# Altium schematic sheet Output.SchDoc
size A2; SheetNumber: 4; SheetTotal: 6
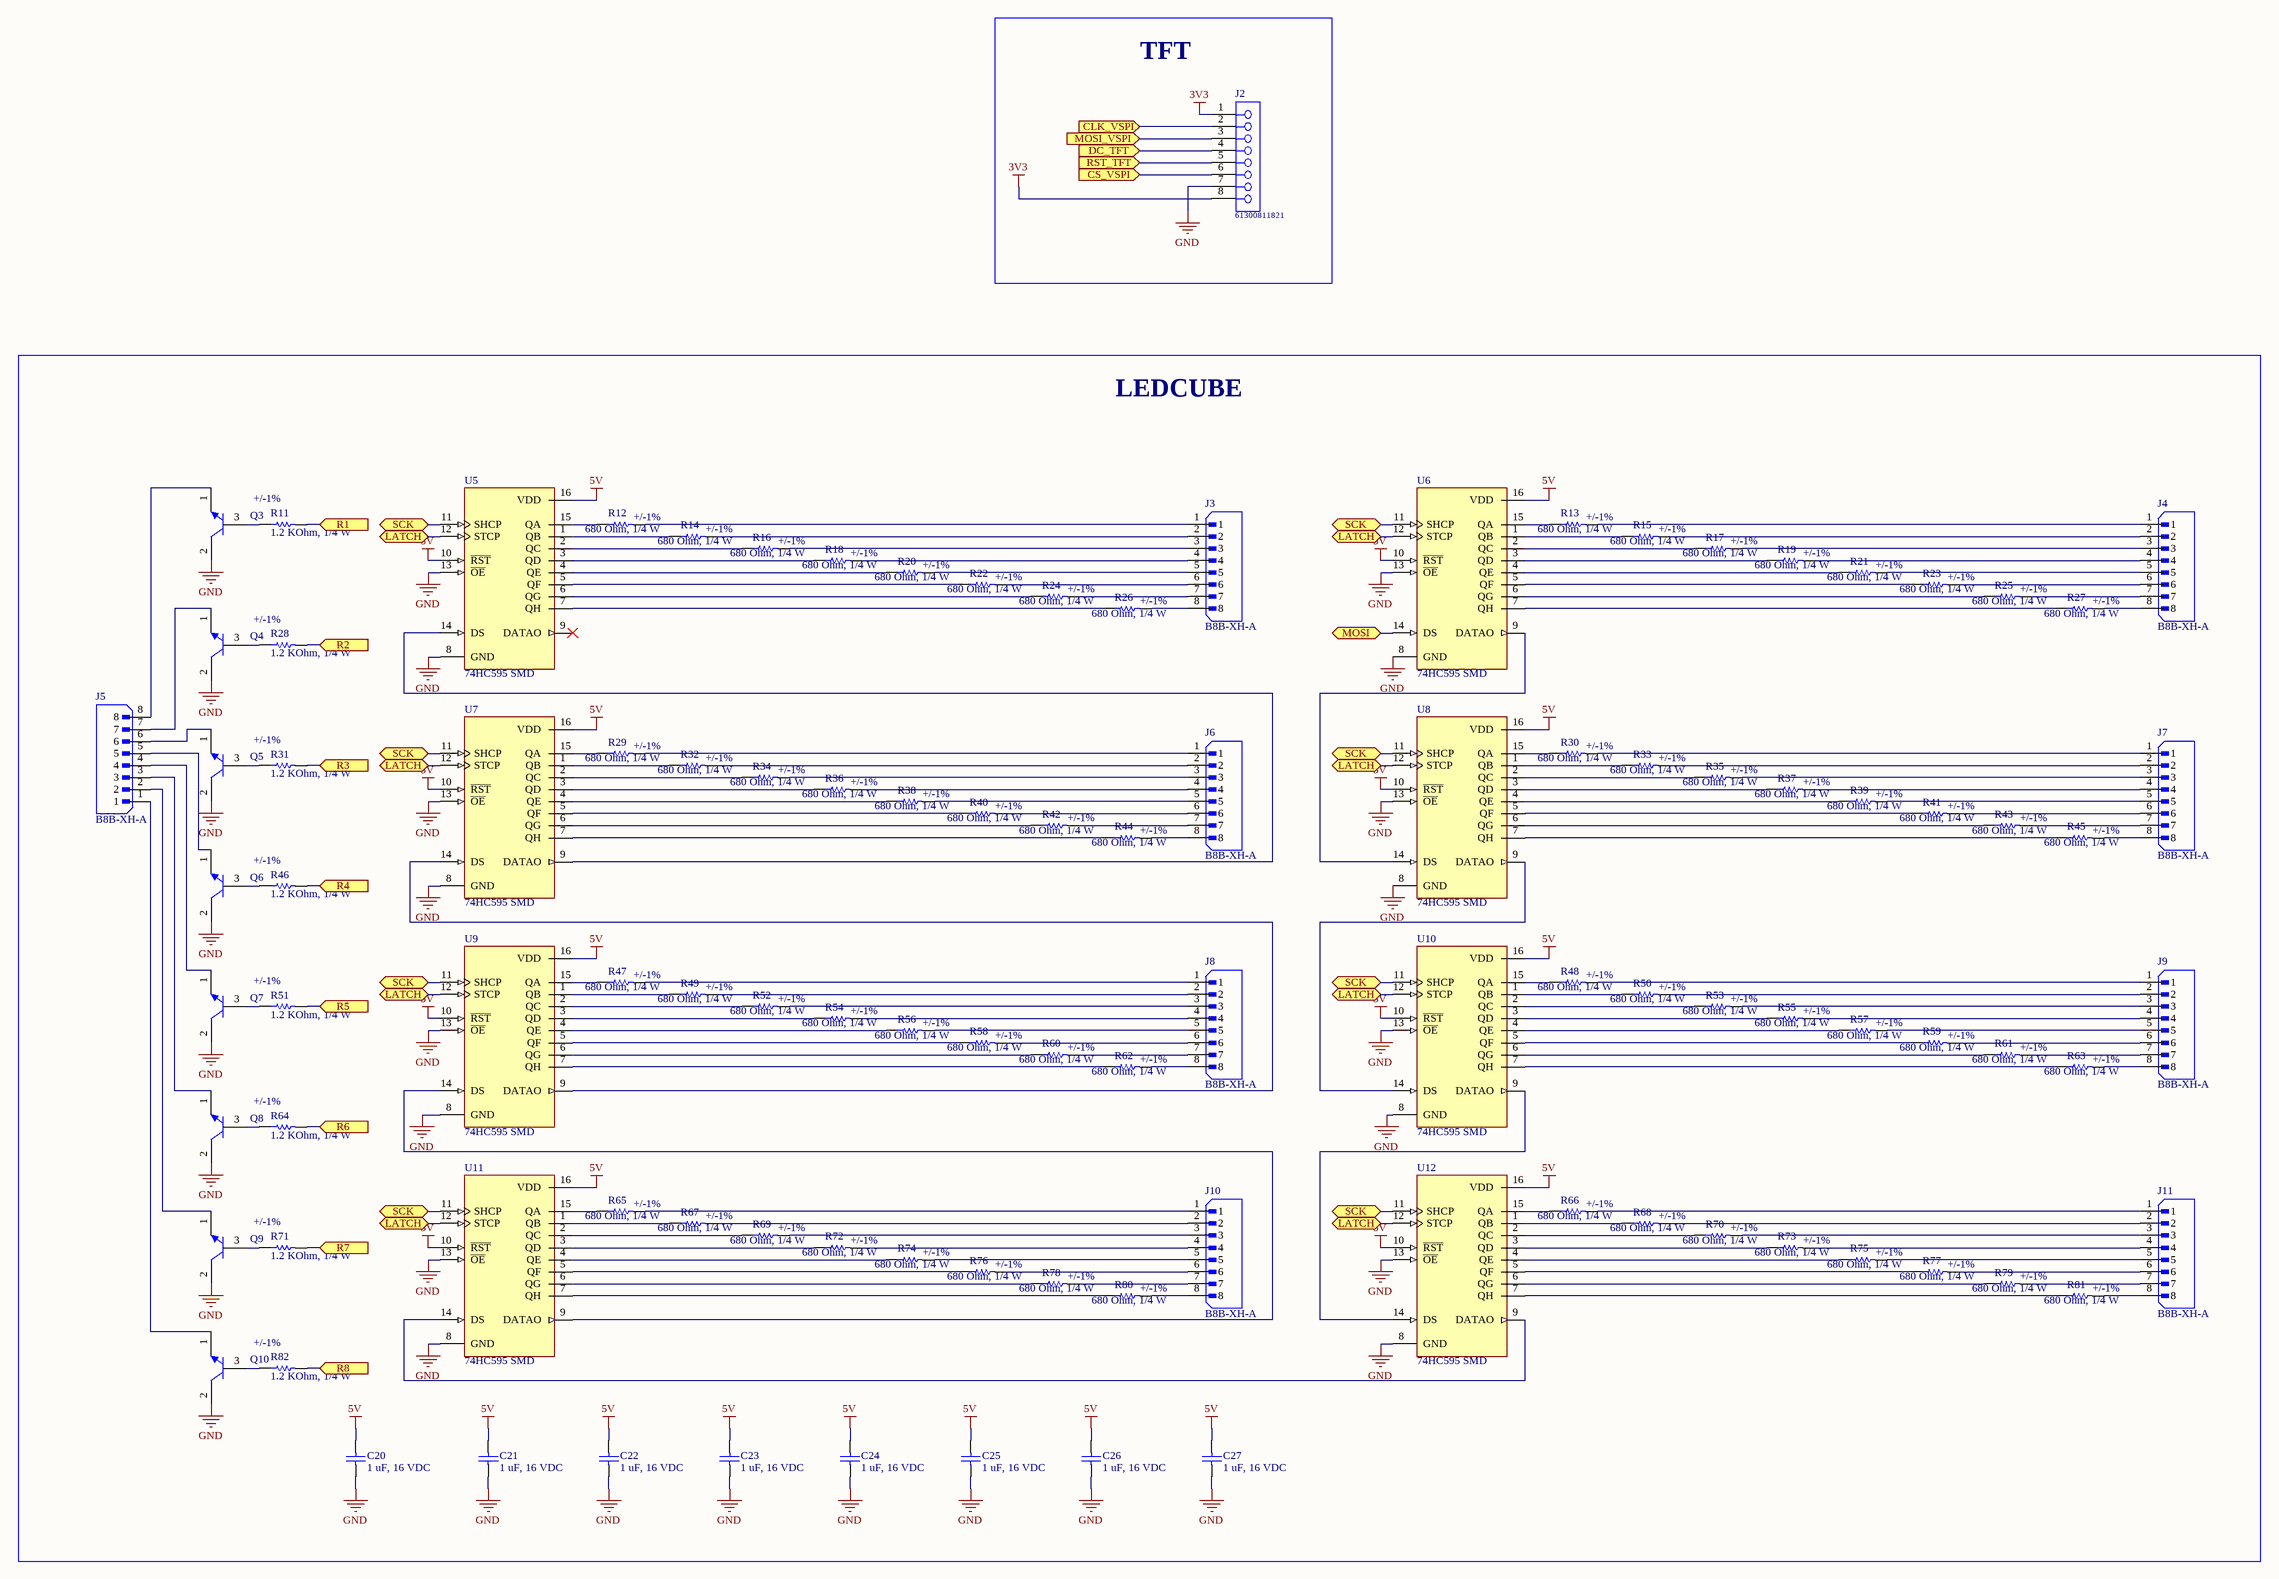
[diagram p0: Output.SchDoc]

## Parts
C20  1 uF, 16 VDC  [CAP_0603]
C21  1 uF, 16 VDC  [CAP_0603]
C22  1 uF, 16 VDC  [CAP_0603]
C23  1 uF, 16 VDC  [CAP_0603]
C24  1 uF, 16 VDC  [CAP_0603]
C25  1 uF, 16 VDC  [CAP_0603]
C26  1 uF, 16 VDC  [CAP_0603]
C27  1 uF, 16 VDC  [CAP_0603]
J2  61300811821  [61300811821]
J3  B8B-XH-A  [JST_B8B-XH-A]
J4  B8B-XH-A  [JST_B8B-XH-A]
J5  B8B-XH-A  [JST_B8B-XH-A]
J6  B8B-XH-A  [JST_B8B-XH-A]
J7  B8B-XH-A  [JST_B8B-XH-A]
J8  B8B-XH-A  [JST_B8B-XH-A]
J9  B8B-XH-A  [JST_B8B-XH-A]
J10  B8B-XH-A  [JST_B8B-XH-A]
J11  B8B-XH-A  [JST_B8B-XH-A]
Q3  C1815  [SOT23B]  (value not drawn)
Q4  C1815  [SOT23B]  (value not drawn)
Q5  C1815  [SOT23B]  (value not drawn)
Q6  C1815  [SOT23B]  (value not drawn)
Q7  C1815  [SOT23B]  (value not drawn)
Q8  C1815  [SOT23B]  (value not drawn)
Q9  C1815  [SOT23B]  (value not drawn)
Q10  C1815  [SOT23B]  (value not drawn)
R11  1.2 KOhm, 1/4 W  Resistance Tolerance: +/-1%  [resistor_0603]
R12  680 Ohm, 1/4 W  Resistance Tolerance: +/-1%  [resistor_0603]
R13  680 Ohm, 1/4 W  Resistance Tolerance: +/-1%  [resistor_0603]
R14  680 Ohm, 1/4 W  Resistance Tolerance: +/-1%  [resistor_0603]
R15  680 Ohm, 1/4 W  Resistance Tolerance: +/-1%  [resistor_0603]
R16  680 Ohm, 1/4 W  Resistance Tolerance: +/-1%  [resistor_0603]
R17  680 Ohm, 1/4 W  Resistance Tolerance: +/-1%  [resistor_0603]
R18  680 Ohm, 1/4 W  Resistance Tolerance: +/-1%  [resistor_0603]
R19  680 Ohm, 1/4 W  Resistance Tolerance: +/-1%  [resistor_0603]
R20  680 Ohm, 1/4 W  Resistance Tolerance: +/-1%  [resistor_0603]
R21  680 Ohm, 1/4 W  Resistance Tolerance: +/-1%  [resistor_0603]
R22  680 Ohm, 1/4 W  Resistance Tolerance: +/-1%  [resistor_0603]
R23  680 Ohm, 1/4 W  Resistance Tolerance: +/-1%  [resistor_0603]
R24  680 Ohm, 1/4 W  LATCH: +/-1%  [resistor_0603]
R25  680 Ohm, 1/4 W  Resistance Tolerance: +/-1%  [resistor_0603]
R26  680 Ohm, 1/4 W  Resistance Tolerance: +/-1%  [resistor_0603]
R27  680 Ohm, 1/4 W  Resistance Tolerance: +/-1%  [resistor_0603]
R28  1.2 KOhm, 1/4 W  Resistance Tolerance: +/-1%  [resistor_0603]
R29  680 Ohm, 1/4 W  Resistance Tolerance: +/-1%  [resistor_0603]
R30  680 Ohm, 1/4 W  Resistance Tolerance: +/-1%  [resistor_0603]
R31  1.2 KOhm, 1/4 W  Resistance Tolerance: +/-1%  [resistor_0603]
R32  680 Ohm, 1/4 W  Resistance Tolerance: +/-1%  [resistor_0603]
R33  680 Ohm, 1/4 W  Resistance Tolerance: +/-1%  [resistor_0603]
R34  680 Ohm, 1/4 W  Resistance Tolerance: +/-1%  [resistor_0603]
R35  680 Ohm, 1/4 W  Resistance Tolerance: +/-1%  [resistor_0603]
R36  680 Ohm, 1/4 W  Resistance Tolerance: +/-1%  [resistor_0603]
R37  680 Ohm, 1/4 W  Resistance Tolerance: +/-1%  [resistor_0603]
R38  680 Ohm, 1/4 W  Resistance Tolerance: +/-1%  [resistor_0603]
R39  680 Ohm, 1/4 W  Resistance Tolerance: +/-1%  [resistor_0603]
R40  680 Ohm, 1/4 W  Resistance Tolerance: +/-1%  [resistor_0603]
R41  680 Ohm, 1/4 W  Resistance Tolerance: +/-1%  [resistor_0603]
R42  680 Ohm, 1/4 W  Resistance Tolerance: +/-1%  [resistor_0603]
R43  680 Ohm, 1/4 W  Resistance Tolerance: +/-1%  [resistor_0603]
R44  680 Ohm, 1/4 W  Resistance Tolerance: +/-1%  [resistor_0603]
R45  680 Ohm, 1/4 W  Resistance Tolerance: +/-1%  [resistor_0603]
R46  1.2 KOhm, 1/4 W  Resistance Tolerance: +/-1%  [resistor_0603]
R47  680 Ohm, 1/4 W  Resistance Tolerance: +/-1%  [resistor_0603]
R48  680 Ohm, 1/4 W  Resistance Tolerance: +/-1%  [resistor_0603]
R49  680 Ohm, 1/4 W  Resistance Tolerance: +/-1%  [resistor_0603]
R50  680 Ohm, 1/4 W  Resistance Tolerance: +/-1%  [resistor_0603]
R51  1.2 KOhm, 1/4 W  Resistance Tolerance: +/-1%  [resistor_0603]
R52  680 Ohm, 1/4 W  Resistance Tolerance: +/-1%  [resistor_0603]
R53  680 Ohm, 1/4 W  Resistance Tolerance: +/-1%  [resistor_0603]
R54  680 Ohm, 1/4 W  Resistance Tolerance: +/-1%  [resistor_0603]
R55  680 Ohm, 1/4 W  Resistance Tolerance: +/-1%  [resistor_0603]
R56  680 Ohm, 1/4 W  Resistance Tolerance: +/-1%  [resistor_0603]
R57  680 Ohm, 1/4 W  Resistance Tolerance: +/-1%  [resistor_0603]
R58  680 Ohm, 1/4 W  Resistance Tolerance: +/-1%  [resistor_0603]
R59  680 Ohm, 1/4 W  Resistance Tolerance: +/-1%  [resistor_0603]
R60  680 Ohm, 1/4 W  Resistance Tolerance: +/-1%  [resistor_0603]
R61  680 Ohm, 1/4 W  Resistance Tolerance: +/-1%  [resistor_0603]
R62  680 Ohm, 1/4 W  Resistance Tolerance: +/-1%  [resistor_0603]
R63  680 Ohm, 1/4 W  Resistance Tolerance: +/-1%  [resistor_0603]
R64  1.2 KOhm, 1/4 W  Resistance Tolerance: +/-1%  [resistor_0603]
R65  680 Ohm, 1/4 W  Resistance Tolerance: +/-1%  [resistor_0603]
R66  680 Ohm, 1/4 W  Resistance Tolerance: +/-1%  [resistor_0603]
R67  680 Ohm, 1/4 W  Resistance Tolerance: +/-1%  [resistor_0603]
R68  680 Ohm, 1/4 W  Resistance Tolerance: +/-1%  [resistor_0603]
R69  680 Ohm, 1/4 W  Resistance Tolerance: +/-1%  [resistor_0603]
R70  680 Ohm, 1/4 W  Resistance Tolerance: +/-1%  [resistor_0603]
R71  1.2 KOhm, 1/4 W  Resistance Tolerance: +/-1%  [resistor_0603]
R72  680 Ohm, 1/4 W  Resistance Tolerance: +/-1%  [resistor_0603]
R73  680 Ohm, 1/4 W  Resistance Tolerance: +/-1%  [resistor_0603]
R74  680 Ohm, 1/4 W  Resistance Tolerance: +/-1%  [resistor_0603]
R75  680 Ohm, 1/4 W  Resistance Tolerance: +/-1%  [resistor_0603]
R76  680 Ohm, 1/4 W  Resistance Tolerance: +/-1%  [resistor_0603]
R77  680 Ohm, 1/4 W  Resistance Tolerance: +/-1%  [resistor_0603]
R78  680 Ohm, 1/4 W  Resistance Tolerance: +/-1%  [resistor_0603]
R79  680 Ohm, 1/4 W  Resistance Tolerance: +/-1%  [resistor_0603]
R80  680 Ohm, 1/4 W  Resistance Tolerance: +/-1%  [resistor_0603]
R81  680 Ohm, 1/4 W  Resistance Tolerance: +/-1%  [resistor_0603]
R82  1.2 KOhm, 1/4 W  Resistance Tolerance: +/-1%  [resistor_0603]
U5  74HC595 SMD  [SOP 16]
U6  74HC595 SMD  [SOP 16]
U7  74HC595 SMD  [SOP 16]
U8  74HC595 SMD  [SOP 16]
U9  74HC595 SMD  [SOP 16]
U10  74HC595 SMD  [SOP 16]
U11  74HC595 SMD  [SOP 16]
U12  74HC595 SMD  [SOP 16]

## Blocks framed on the sheet
TFT: J2
LEDCUBE: C20-C27 J3-J11 Q3-Q10 R11-R82 U5-U12

## Ports
CLK_VSPI (in, see ESP32[2B]), CS_VSPI (in, see ESP32[2B]), DC_TFT (in, see ESP32[1B]), LATCH (bidir, see MCU[1A], Output[2B], Output[2C], Output[5B], Output[5C]), MOSI (bidir, see MCU[1A]), MOSI_VSPI (in, see ESP32[2B]), R1 (in, see MCU[1B]), R2 (in, see MCU[2A]), R3 (in, see MCU[2A]), R4 (in, see MCU[2A]), R5 (in, see MCU[2A]), R6 (in, see MCU[2A]), R7 (in, see MCU[2A]), R8 (in, see MCU[2B]), RST_TFT (in, see ESP32[1B]), SCK (bidir, see MCU[1A], Output[2B], Output[2C], Output[5B], Output[5C])

## Nets
3V3: J2.1 J2.8
5V: C20.2 C21.2 C22.2 C23.2 C24.2 C25.2 C26.2 C27.2 U5.10(~{RST}) U5.16(VDD) U6.10(~{RST}) U6.16(VDD) U7.10(~{RST}) U7.16(VDD) U8.10(~{RST}) U8.16(VDD) U9.10(~{RST}) U9.16(VDD) U10.10(~{RST}) U10.16(VDD) U11.10(~{RST}) U11.16(VDD) U12.10(~{RST}) U12.16(VDD)
GND: C20.1 C21.1 C22.1 C23.1 C24.1 C25.1 C26.1 C27.1 J2.7 Q3.2(C) Q4.2(C) Q5.2(C) Q6.2(C) Q7.2(C) Q8.2(C) Q9.2(C) Q10.2(C) U5.8(GND) U5.13(~{OE}) U6.8(GND) U6.13(~{OE}) U7.8(GND) U7.13(~{OE}) U8.8(GND) U8.13(~{OE}) U9.8(GND) U9.13(~{OE}) U10.8(GND) U10.13(~{OE}) U11.8(GND) U11.13(~{OE}) U12.8(GND) U12.13(~{OE})
CLK_VSPI: J2.2 ; port CLK_VSPI
CS_VSPI: J2.6 ; port CS_VSPI
DC_TFT: J2.4 ; port DC_TFT
LATCH: U5.12(STCP) U6.12(STCP) U7.12(STCP) U8.12(STCP) U9.12(STCP) U10.12(STCP) U11.12(STCP) U12.12(STCP) ; port LATCH
MOSI: U6.14(DS) ; port MOSI
MOSI_VSPI: J2.3 ; port MOSI_VSPI
R1: R11.2 ; port R1
R2: R28.2 ; port R2
R3: R31.2 ; port R3
R4: R46.2 ; port R4
R5: R51.2 ; port R5
R6: R64.2 ; port R6
R7: R71.2 ; port R7
R8: R82.2 ; port R8
RST_TFT: J2.5 ; port RST_TFT
SCK: U5.11(SHCP) U6.11(SHCP) U7.11(SHCP) U8.11(SHCP) U9.11(SHCP) U10.11(SHCP) U11.11(SHCP) U12.11(SHCP) ; port SCK
NetJ3_1: J3.1 R12.2
NetJ3_2: J3.2 R14.2
NetJ3_3: J3.3 R16.2
NetJ3_4: J3.4 R18.2
NetJ3_5: J3.5 R20.2
NetJ3_6: J3.6 R22.2
NetJ3_7: J3.7 R24.2
NetJ3_8: J3.8 R26.2
NetJ4_1: J4.1 R13.2
NetJ4_2: J4.2 R15.2
NetJ4_3: J4.3 R17.2
NetJ4_4: J4.4 R19.2
NetJ4_5: J4.5 R21.2
NetJ4_6: J4.6 R23.2
NetJ4_7: J4.7 R25.2
NetJ4_8: J4.8 R27.2
NetJ5_1: J5.1 Q10.1(E)
NetJ5_2: J5.2 Q9.1(E)
NetJ5_3: J5.3 Q8.1(E)
NetJ5_4: J5.4 Q7.1(E)
NetJ5_5: J5.5 Q6.1(E)
NetJ5_6: J5.6 Q5.1(E)
NetJ5_7: J5.7 Q4.1(E)
NetJ5_8: J5.8 Q3.1(E)
NetJ6_1: J6.1 R29.2
NetJ6_2: J6.2 R32.2
NetJ6_3: J6.3 R34.2
NetJ6_4: J6.4 R36.2
NetJ6_5: J6.5 R38.2
NetJ6_6: J6.6 R40.2
NetJ6_7: J6.7 R42.2
NetJ6_8: J6.8 R44.2
NetJ7_1: J7.1 R30.2
NetJ7_2: J7.2 R33.2
NetJ7_3: J7.3 R35.2
NetJ7_4: J7.4 R37.2
NetJ7_5: J7.5 R39.2
NetJ7_6: J7.6 R41.2
NetJ7_7: J7.7 R43.2
NetJ7_8: J7.8 R45.2
NetJ8_1: J8.1 R47.2
NetJ8_2: J8.2 R49.2
NetJ8_3: J8.3 R52.2
NetJ8_4: J8.4 R54.2
NetJ8_5: J8.5 R56.2
NetJ8_6: J8.6 R58.2
NetJ8_7: J8.7 R60.2
NetJ8_8: J8.8 R62.2
NetJ9_1: J9.1 R48.2
NetJ9_2: J9.2 R50.2
NetJ9_3: J9.3 R53.2
NetJ9_4: J9.4 R55.2
NetJ9_5: J9.5 R57.2
NetJ9_6: J9.6 R59.2
NetJ9_7: J9.7 R61.2
NetJ9_8: J9.8 R63.2
NetJ10_1: J10.1 R65.2
NetJ10_2: J10.2 R67.2
NetJ10_3: J10.3 R69.2
NetJ10_4: J10.4 R72.2
NetJ10_5: J10.5 R74.2
NetJ10_6: J10.6 R76.2
NetJ10_7: J10.7 R78.2
NetJ10_8: J10.8 R80.2
NetJ11_1: J11.1 R66.2
NetJ11_2: J11.2 R68.2
NetJ11_3: J11.3 R70.2
NetJ11_4: J11.4 R73.2
NetJ11_5: J11.5 R75.2
NetJ11_6: J11.6 R77.2
NetJ11_7: J11.7 R79.2
NetJ11_8: J11.8 R81.2
NetQ3_3: Q3.3(B) R11.1
NetQ4_3: Q4.3(B) R28.1
NetQ5_3: Q5.3(B) R31.1
NetQ6_3: Q6.3(B) R46.1
NetQ7_3: Q7.3(B) R51.1
NetQ8_3: Q8.3(B) R64.1
NetQ9_3: Q9.3(B) R71.1
NetQ10_3: Q10.3(B) R82.1
NetR12_1: R12.1 U5.15(QA)
NetR13_1: R13.1 U6.15(QA)
NetR14_1: R14.1 U5.1(QB)
NetR15_1: R15.1 U6.1(QB)
NetR16_1: R16.1 U5.2(QC)
NetR17_1: R17.1 U6.2(QC)
NetR18_1: R18.1 U5.3(QD)
NetR19_1: R19.1 U6.3(QD)
NetR20_1: R20.1 U5.4(QE)
NetR21_1: R21.1 U6.4(QE)
NetR22_1: R22.1 U5.5(QF)
NetR23_1: R23.1 U6.5(QF)
NetR24_1: R24.1 U5.6(QG)
NetR25_1: R25.1 U6.6(QG)
NetR26_1: R26.1 U5.7(QH)
NetR27_1: R27.1 U6.7(QH)
NetR29_1: R29.1 U7.15(QA)
NetR30_1: R30.1 U8.15(QA)
NetR32_1: R32.1 U7.1(QB)
NetR33_1: R33.1 U8.1(QB)
NetR34_1: R34.1 U7.2(QC)
NetR35_1: R35.1 U8.2(QC)
NetR36_1: R36.1 U7.3(QD)
NetR37_1: R37.1 U8.3(QD)
NetR38_1: R38.1 U7.4(QE)
NetR39_1: R39.1 U8.4(QE)
NetR40_1: R40.1 U7.5(QF)
NetR41_1: R41.1 U8.5(QF)
NetR42_1: R42.1 U7.6(QG)
NetR43_1: R43.1 U8.6(QG)
NetR44_1: R44.1 U7.7(QH)
NetR45_1: R45.1 U8.7(QH)
NetR47_1: R47.1 U9.15(QA)
NetR48_1: R48.1 U10.15(QA)
NetR49_1: R49.1 U9.1(QB)
NetR50_1: R50.1 U10.1(QB)
NetR52_1: R52.1 U9.2(QC)
NetR53_1: R53.1 U10.2(QC)
NetR54_1: R54.1 U9.3(QD)
NetR55_1: R55.1 U10.3(QD)
NetR56_1: R56.1 U9.4(QE)
NetR57_1: R57.1 U10.4(QE)
NetR58_1: R58.1 U9.5(QF)
NetR59_1: R59.1 U10.5(QF)
NetR60_1: R60.1 U9.6(QG)
NetR61_1: R61.1 U10.6(QG)
NetR62_1: R62.1 U9.7(QH)
NetR63_1: R63.1 U10.7(QH)
NetR65_1: R65.1 U11.15(QA)
NetR66_1: R66.1 U12.15(QA)
NetR67_1: R67.1 U11.1(QB)
NetR68_1: R68.1 U12.1(QB)
NetR69_1: R69.1 U11.2(QC)
NetR70_1: R70.1 U12.2(QC)
NetR72_1: R72.1 U11.3(QD)
NetR73_1: R73.1 U12.3(QD)
NetR74_1: R74.1 U11.4(QE)
NetR75_1: R75.1 U12.4(QE)
NetR76_1: R76.1 U11.5(QF)
NetR77_1: R77.1 U12.5(QF)
NetR78_1: R78.1 U11.6(QG)
NetR79_1: R79.1 U12.6(QG)
NetR80_1: R80.1 U11.7(QH)
NetR81_1: R81.1 U12.7(QH)
NetU5_14: U5.14(DS) U7.9(DATAO)
NetU6_9: U6.9(DATAO) U8.14(DS)
NetU7_14: U7.14(DS) U9.9(DATAO)
NetU8_9: U8.9(DATAO) U10.14(DS)
NetU9_14: U9.14(DS) U11.9(DATAO)
NetU10_9: U10.9(DATAO) U12.14(DS)
NetU11_14: U11.14(DS) U12.9(DATAO)

Not connected (* = marked no-connect by the designer): U5 9(DATAO)*

## Library data of the parts
C20-C27 = 0106031051016: CAP, size 0603, 1 uF, 16 VDC; Manufacture Name: Samsung Electro-Mechanics; Manufacture SN: CL10B105KO8NNWC; Capacitance: 1 uF; Tolerance: +/-10%; Voltage Rating DC: 16 VDC; ComponentLink2Description: Datasheet; ComponentLink2URL: https://www.mouser.vn/datasheet/2/585/Samsung_MLCC_1837944-1929650.pdf; Operating Temperature: -55 to +125degC; Packaging: Tape and Reel; Mounting Technology: SMT; Size: 0603; Supplier 1 Name: Mouser; Supplier 1 SN: 187-CL10B105KO8NNWC; Supplier 1 URL: https://www.mouser.vn/ProductDetail/Samsung-Electro-Mechanics/CL10B105KO8NNWC?qs=81r%252BiQLm7BT%252BXtc72qn1ug%3D%3D&utm_source=mouser-refine-download&utm_medium=file&utm_campaign=CL10B105KO8NNWC&utm_content=Samsung-Electro-Mechanics; Supplier 2 Name: Digi-Key; Supplier 2 SN: 1276-CL10B105KO8NNWCTR-ND; Supplier 2 URL: https://www.digikey.com/en/products/detail/samsung-electro-mechanics/cl10b105ko8nnwc/16572783; Supplier 3 Name: thegioiic; Supplier 3 SN: N/A; Supplier 3 URL: https://www.thegioiic.com/tu-gom-0603-1uf-16v; Value: 1 uF, 16 VDC
J2 = 61300811821: WR-PHD Socket Header, THT, pitch 2.54mm, Single Row, Vertical, 8p; Manufacturer: Wurth Elektronik; Pin Number: 8; Rated Current: 3A; Working Voltage: 250VAC; Withstanding Voltage: 500VAC; Contact Resistance: 20mOhm; ComponentLink1Description: Manufacturer; ComponentLink1URL: http://www.we-online.de; ComponentLink2Description: Datasheet; ComponentLink2URL: https://www.we-online.com/catalog/datasheet/61300811821.pdf; Manufacturer Part Number: 61300811821; Published Date: May 2020; Pitch: 2.54mm; Operating Temperature: -40 to +125degC; Mounting Technology: THT; Packaging: Tray; Gender: Socket Header; Row Number: Single; Orientation: Vertical; ComponentLink3Description: Global Supply; ComponentLink3URL: https://www.we-online.com/en/components/products/PHD_2_54_SOCKET_HEADER_6130XX11821?sq=61300811821#61300811821; ComponentLink4Description: Global Supply; ComponentLink4URL: https://www.mouser.vn/ProductDetail/Wurth-Elektronik/61300811821?qs=ulEaXIWI0c%252BOxrSqc7jVmQ%3D%3D; ComponentLink5Description: Local Supply; ComponentLink5URL: https://www.thegioiic.com/hang-rao-cai-don-2-54mm-8-chan-1-hang-cao-11-8mm-xuyen-lo; Supplier 1 Name: Mouser; Supplier 1 SN: 710-61300811821; Supplier 1 URL: https://www.mouser.vn/ProductDetail/Wurth-Elektronik/61300811821?qs=ulEaXIWI0c%252BOxrSqc7jVmQ%3D%3D; Supplier 2 Name: Digi-Key; Supplier 2 SN: N/A; Supplier 2 URL: N/A; Supplier 3 Name: thegioiic; Supplier 3 SN: N/A; Supplier 3 URL: https://www.thegioiic.com/hang-rao-cai-don-2-54mm-8-chan-1-hang-cao-11-8mm-xuyen-lo
J3-J11 = B8B-XH-A: Connector Header Through Hole 8 position 0.098 (2.50mm); MF: JST; SnapEDA_Link: https://www.snapeda.com/parts/B8B-XH-A/JST/view-part/?ref=snap; Package: None; Value: *; MP: B8B-XH-A; Check_prices: https://www.snapeda.com/parts/B8B-XH-A/JST/view-part/?ref=eda
Q3-Q10 = C1815: NPN Bipolar Transistor
R11 R28 R31 R46 R51 R64 R71 R82 = 0006031221: RES, size 0603, 1.2 KOhm, 1/4 W; Manufacture  Name: OEM; Rated Power: 1/4 W; Resistance: 1.2 KOhm; Size: 0603; Mounting Technology: SMT; Supplier 1 Name: Mouser; Supplier 1 SN: 667-ERJ-UP3F1201V; Supplier 2 Name: Digi-Key; Supplier 2 SN: 10-ERJ-UP3F1201VTR-ND 10-ERJ-UP3F1201VCT-ND 10-ERJ-UP3F1201VDKR-ND; Supplier 1 URL: https://www.mouser.vn/ProductDetail/Panasonic/ERJ-UP3F1201V?qs=sGAEpiMZZMvdGkrng054twq3eZrCFN895BO3G72d%2F02jECAea43bgQ%3D%3D; Supplier 3 Name: thegioiic; Supplier 3 SN: N/A; Supplier 3 URL: N/A; Manufacture  SN: OEM; Value: 1.2 KOhm, 1/4 W; ComponentLink1Description: Datasheet link; ComponentLink1URL: https://api.pim.na.industrial.panasonic.com/file_stream/main/fileversion/4484; ComponentLink2Description: Supplier 1 URL; ComponentLink2URL: N/A; ComponentLink3Description: Supplier 2 URL; ComponentLink3URL: N/A; ComponentLink4Description: Supplier 3 URL; ComponentLink4URL: N/A; Supplier 2 URL: N/A
R12-R27 R29 R30 R32-R45 R47-R50 R52-R63 R65-R70 R72-R81 = 0006036811: RES, size 0603, 680 Ohm, 1/4 W; Manufacture  Name: OEM; Resistance: 680 Ohm; Rated Power: 1/4 W; Size: 0603; Mounting Technology: SMT; Supplier 1 Name: Mouser; Supplier 1 SN: 755-ESR03EZPF6800; Supplier 2 Name: Digi-Key; Supplier 2 SN: 511-ESR03EZPF6800TR-ND 511-ESR03EZPF6800CT-ND 511-ESR03EZPF6800DKR-ND; Supplier 1 URL: https://www.mouser.vn/ProductDetail/ROHM-Semiconductor/ESR03EZPF6800?qs=sGAEpiMZZMvdGkrng054tywGjayRHxH2%252BpGMJaiHRuJd8MneXKUC7g%3D%3D; Supplier 3 Name: thegioiic; Supplier 3 SN: N/A; Supplier 3 URL: N/A; Manufacture  SN: OEM; Value: 680 Ohm, 1/4 W; ComponentLink1Description: Datasheet link; ComponentLink1URL: https://fscdn.rohm.com/en/products/databook/datasheet/passive/resistor/chip_resistor/esr-e.pdf; ComponentLink2Description: Supplier 1 URL; ComponentLink2URL: N/A; ComponentLink3Description: Supplier 2 URL; ComponentLink3URL: https://www.digikey.com/en/products/detail/rohm-semiconductor/ESR03EZPF6800/4007267; ComponentLink4Description: Supplier 3 URL; ComponentLink4URL: N/A; Supplier 2 URL: https://www.digikey.com/en/products/detail/rohm-semiconductor/ESR03EZPF6800/4007267
U5-U12 = 74HC595 SMD: Dán; Ten_Linh_Kien: 74HC595D SOP16; Don_Vi: Con; Ma_Hang: MH000672; Ghi_Chu: *; Kieu_Chan: *; Chung_Loai: Dán